# Altium schematic sheet Microcontroller.SchDoc
size 381 x 241 mm; SheetNumber: 3; SheetTotal: 9
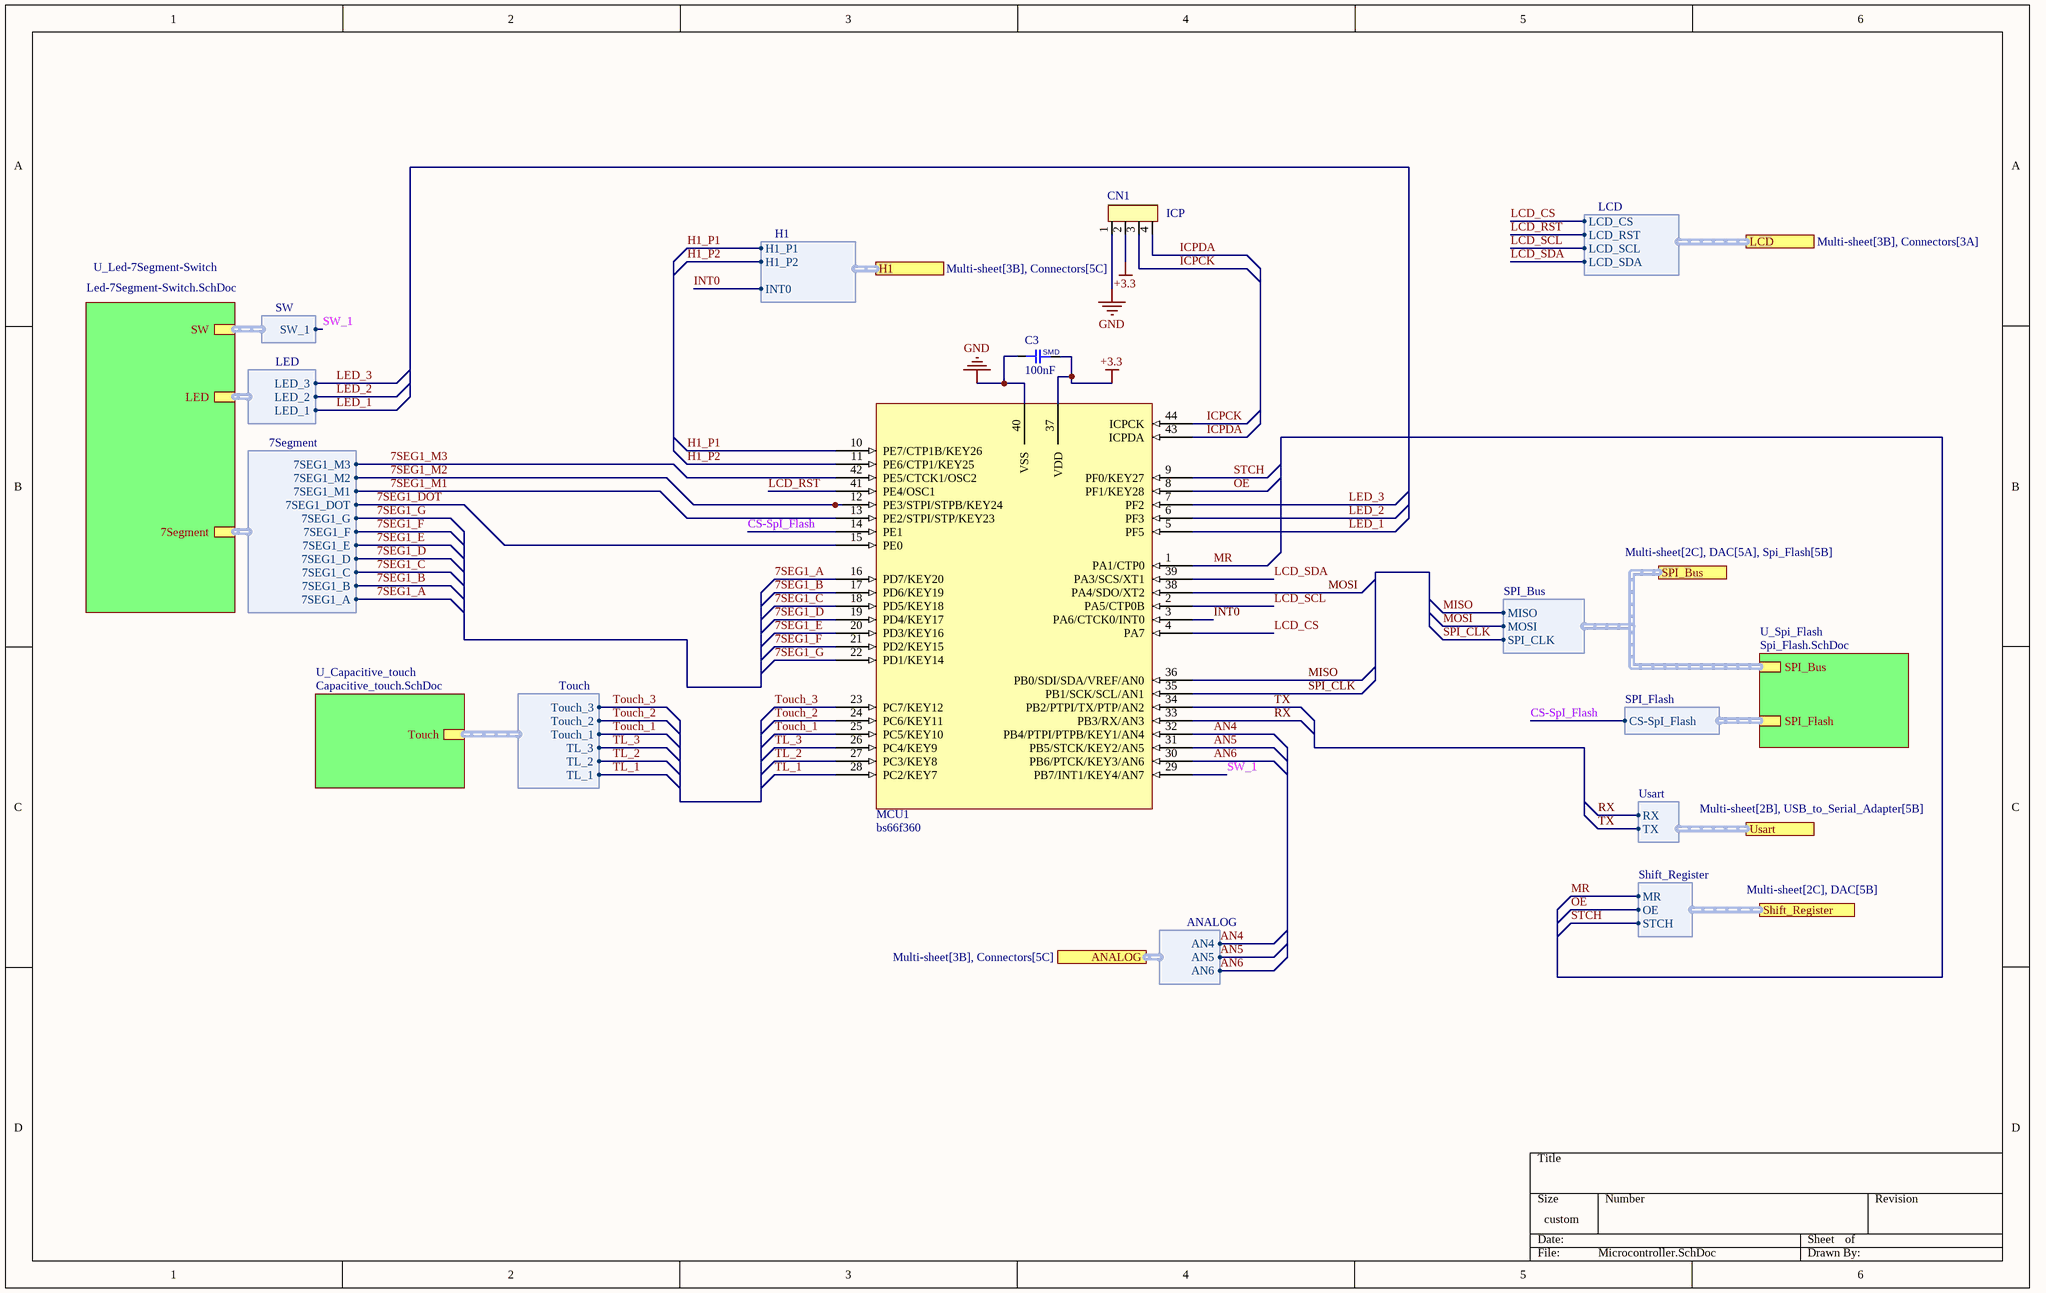
[diagram p0: Microcontroller.SchDoc]

## Parts
C3  100nF  [CAP-0603]
CN1  ICP  [CONECTOR/XH/4PIN]
MCU1  bs66f360  [bs66f360]

## Sub-sheets
U_Capacitive_touch = Capacitive_touch.SchDoc: Touch (harness Touch)
U_Led-7Segment-Switch = Led-7Segment-Switch.SchDoc: LED (harness LED), 7Segment (harness 7Segment), SW (harness SW)
U_Spi_Flash = Spi_Flash.SchDoc: SPI_Flash (harness SPI_Flash), SPI_Bus (harness SPI_Bus)

## Ports
ANALOG (harness ANALOG, see Multi-sheet[3B], Connectors[5C]), H1 (harness H1, see Multi-sheet[3B], Connectors[5C]), LCD (harness LCD, see Multi-sheet[3B], Connectors[3A]), Shift_Register (harness Shift_Register, see Multi-sheet[2C], DAC[5B]), SPI_Bus (harness SPI_Bus, see Multi-sheet[2C], DAC[5A], Spi_Flash[5B]), Usart (harness Usart, see Multi-sheet[2B], USB_to_Serial_Adapter[5B])

## Harnesses
7Segment: 7SEG1_A, 7SEG1_B, 7SEG1_C, 7SEG1_D, 7SEG1_DOT, 7SEG1_E, 7SEG1_F, 7SEG1_G, 7SEG1_M1, 7SEG1_M2, 7SEG1_M3
LED: LED_1, LED_2, LED_3
SW: SW_1
SPI_Bus: MISO, MOSI, SPI_CLK
SPI_Flash: CS-SpI_Flash
Usart: RX, TX
Shift_Register: MR, OE, STCH
Touch: TL_1, TL_2, TL_3, Touch_1, Touch_2, Touch_3
LCD: LCD_CS, LCD_RST, LCD_SCL, LCD_SDA
H1: H1_P1, H1_P2, INT0
ANALOG: AN4, AN5, AN6

## Nets
+3.3: C3.2 CN1.2 MCU1.37(VDD)
GND: C3.1 CN1.1 MCU1.40(VSS)
7SEG1_A: MCU1.16(PD7/KEY20) ; sheet U_Led-7Segment-Switch/7Segment.7SEG1_A
7SEG1_B: MCU1.17(PD6/KEY19) ; sheet U_Led-7Segment-Switch/7Segment.7SEG1_B
7SEG1_C: MCU1.18(PD5/KEY18) ; sheet U_Led-7Segment-Switch/7Segment.7SEG1_C
7SEG1_D: MCU1.19(PD4/KEY17) ; sheet U_Led-7Segment-Switch/7Segment.7SEG1_D
7SEG1_DOT: MCU1.15(PE0) ; sheet U_Led-7Segment-Switch/7Segment.7SEG1_DOT
7SEG1_E: MCU1.20(PD3/KEY16) ; sheet U_Led-7Segment-Switch/7Segment.7SEG1_E
7SEG1_F: MCU1.21(PD2/KEY15) ; sheet U_Led-7Segment-Switch/7Segment.7SEG1_F
7SEG1_G: MCU1.22(PD1/KEY14) ; sheet U_Led-7Segment-Switch/7Segment.7SEG1_G
7SEG1_M1: MCU1.13(PE2/STPI/STP/KEY23) ; sheet U_Led-7Segment-Switch/7Segment.7SEG1_M1
7SEG1_M2: MCU1.12(PE3/STPI/STPB/KEY24) ; sheet U_Led-7Segment-Switch/7Segment.7SEG1_M2
7SEG1_M3: MCU1.42(PE5/CTCK1/OSC2) ; sheet U_Led-7Segment-Switch/7Segment.7SEG1_M3
AN4: MCU1.32(PB4/PTPI/PTPB/KEY1/AN4) ; port ANALOG.AN4
AN5: MCU1.31(PB5/STCK/KEY2/AN5) ; port ANALOG.AN5
AN6: MCU1.30(PB6/PTCK/KEY3/AN6) ; port ANALOG.AN6
CS-SpI_Flash: MCU1.14(PE1) ; sheet U_Spi_Flash/SPI_Flash.CS-SpI_Flash
H1_P1: MCU1.10(PE7/CTP1B/KEY26) ; port H1.H1_P1
H1_P2: MCU1.11(PE6/CTP1/KEY25) ; port H1.H1_P2
ICPCK: CN1.3 MCU1.44(ICPCK)
ICPDA: CN1.4 MCU1.43(ICPDA)
INT0: MCU1.3(PA6/CTCK0/INT0) ; port H1.INT0
LCD_CS: MCU1.4(PA7) ; port LCD.LCD_CS
LCD_RST: MCU1.41(PE4/OSC1) ; port LCD.LCD_RST
LCD_SCL: MCU1.2(PA5/CTP0B) ; port LCD.LCD_SCL
LCD_SDA: MCU1.39(PA3/SCS/XT1) ; port LCD.LCD_SDA
LED_1: MCU1.5(PF5) ; sheet U_Led-7Segment-Switch/LED.LED_1
LED_2: MCU1.6(PF3) ; sheet U_Led-7Segment-Switch/LED.LED_2
LED_3: MCU1.7(PF2) ; sheet U_Led-7Segment-Switch/LED.LED_3
MISO: MCU1.36(PB0/SDI/SDA/VREF/AN0) ; port SPI_Bus.MISO
MOSI: MCU1.38(PA4/SDO/XT2) ; port SPI_Bus.MOSI
MR: MCU1.1(PA1/CTP0) ; port Shift_Register.MR
OE: MCU1.8(PF1/KEY28) ; port Shift_Register.OE
RX: MCU1.33(PB3/RX/AN3) ; port Usart.RX
SPI_CLK: MCU1.35(PB1/SCK/SCL/AN1) ; port SPI_Bus.SPI_CLK
STCH: MCU1.9(PF0/KEY27) ; port Shift_Register.STCH
SW_1: MCU1.29(PB7/INT1/KEY4/AN7) ; sheet U_Led-7Segment-Switch/SW.SW_1
TL_1: MCU1.28(PC2/KEY7) ; sheet U_Capacitive_touch/Touch.TL_1
TL_2: MCU1.27(PC3/KEY8) ; sheet U_Capacitive_touch/Touch.TL_2
TL_3: MCU1.26(PC4/KEY9) ; sheet U_Capacitive_touch/Touch.TL_3
Touch_1: MCU1.25(PC5/KEY10) ; sheet U_Capacitive_touch/Touch.Touch_1
Touch_2: MCU1.24(PC6/KEY11) ; sheet U_Capacitive_touch/Touch.Touch_2
Touch_3: MCU1.23(PC7/KEY12) ; sheet U_Capacitive_touch/Touch.Touch_3
TX: MCU1.34(PB2/PTPI/TX/PTP/AN2) ; port Usart.TX

## Buses and harness runs
harness port SPI_Bus = sheet U_Spi_Flash/SPI_Bus

## Notes on the sheet
- (in symbol cap_smd) SMD

## Library data of the parts
C3 = cap_smd
CN1 = CONECTOR/XH/4PIN